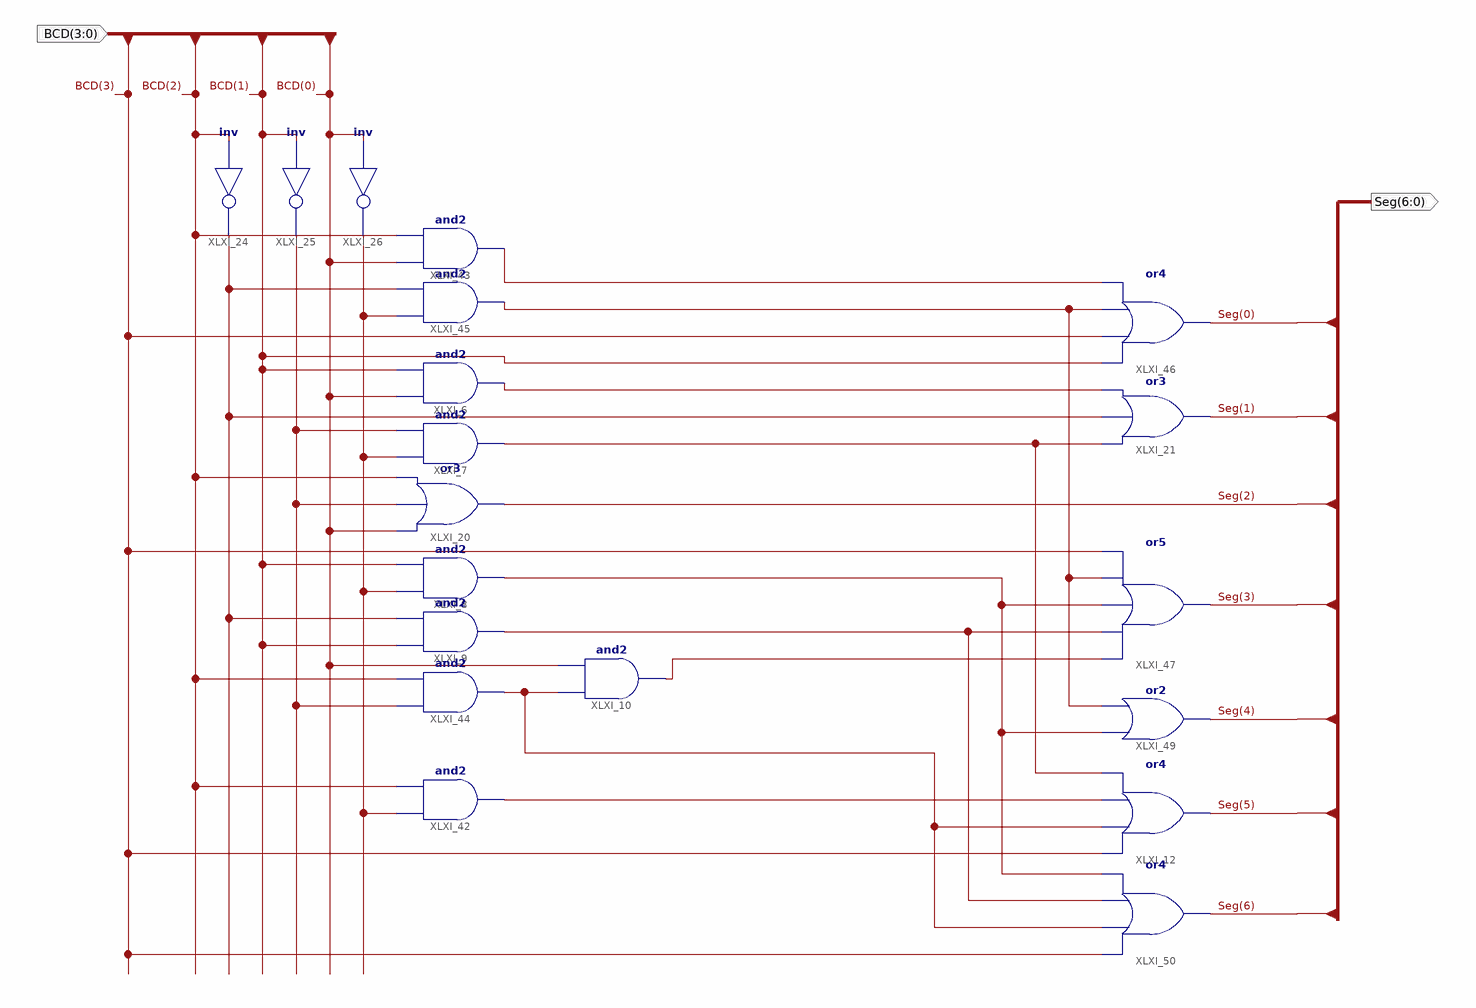
[diagram p0: schematic sheet 1]
// Xilinx ISE schematic BCDto7Seg.sch (spartan6) as structural Verilog: 19 symbols, 2 ports
module BCDto7Seg (
  input  [3:0] BCD,
  output [6:0] Seg
);

  wire XLXN_1, XLXN_7, XLXN_8, XLXN_10, XLXN_12, XLXN_13, XLXN_14, XLXN_15, XLXN_16, XLXN_17, XLXN_19,
       XLXN_83;

  not XLXI_24 (XLXN_7, BCD[2]);
  not XLXI_25 (XLXN_17, BCD[1]);
  not XLXI_26 (XLXN_8, BCD[0]);
  and XLXI_8 (XLXN_12, XLXN_8, BCD[1]);
  or XLXI_20 (Seg[2], BCD[0], XLXN_17, BCD[2]);
  and XLXI_6 (XLXN_10, BCD[0], BCD[1]);
  and XLXI_7 (XLXN_19, XLXN_8, XLXN_17);
  and XLXI_45 (XLXN_83, XLXN_8, XLXN_7);
  and XLXI_43 (XLXN_1, BCD[0], BCD[2]);
  and XLXI_9 (XLXN_13, BCD[1], XLXN_7);
  and XLXI_10 (XLXN_14, XLXN_16, BCD[0]);
  and XLXI_44 (XLXN_16, XLXN_17, BCD[2]);
  or XLXI_49 (Seg[4], XLXN_12, XLXN_83);
  or XLXI_12 (Seg[5], BCD[3], XLXN_16, XLXN_15, XLXN_19);
  and XLXI_42 (XLXN_15, XLXN_8, BCD[2]);
  or XLXI_47 (Seg[3], XLXN_14, XLXN_13, XLXN_12, XLXN_83, BCD[3]);
  or XLXI_50 (Seg[6], BCD[3], XLXN_16, XLXN_13, XLXN_12);
  or XLXI_21 (Seg[1], XLXN_19, XLXN_7, XLXN_10);
  or XLXI_46 (Seg[0], BCD[1], BCD[3], XLXN_83, XLXN_1);
endmodule
